# Altium schematic sheet H_Bridge.SchDoc
size A; SheetNumber: 9; SheetTotal: 9
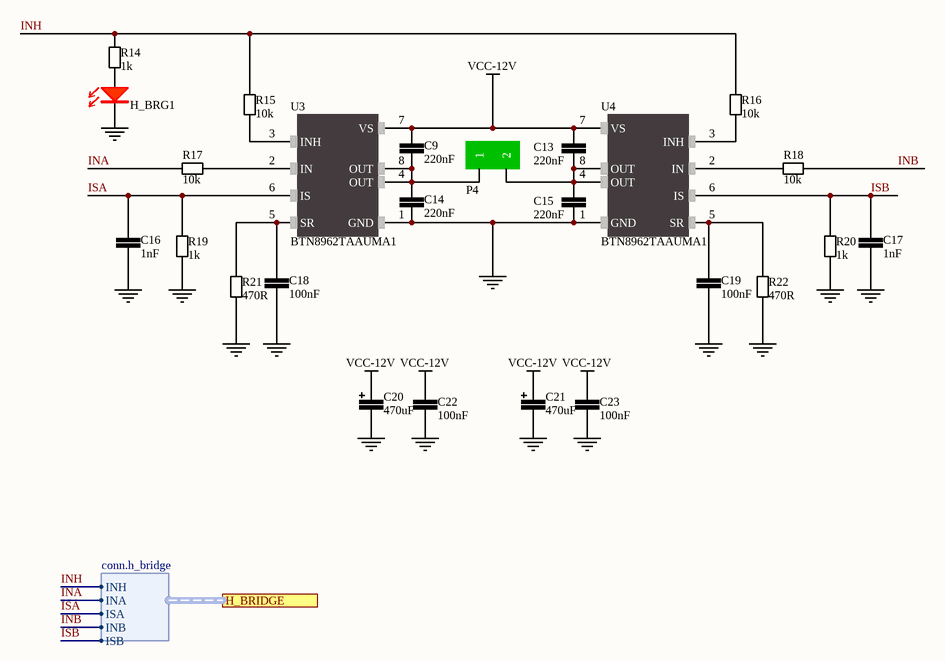
[diagram p0: H_Bridge.SchDoc]

## Parts
C9  220nF  [CER_0805]
C13  220nF  [CER_0805]
C14  220nF  [CER_0805]
C15  220nF  [CER_0805]
C16  1nF  [CER_0805]
C17  1nF  [CER_0805]
C18  100nF  [CER_0805]
C19  100nF  [CER_0805]
C20  470uF  [CAP10X20_RADIAL]
C21  470uF  [CAP10X20_RADIAL]
C22  100nF  [CER_0805]
C23  100nF  [CER_0805]
H_BRG1  LED RED  [LED_RED_0805]  (value not drawn)
P4  *  [MOTOR_CON]  (value not drawn)
R14  1k  [RESC2013X38N-0805-NOOVERLAY]
R15  10k  [RESC2013X38N-0805-NOOVERLAY]
R16  10k  [RESC2013X38N-0805-NOOVERLAY]
R17  10k  [RESC2013X38N-0805-NOOVERLAY]
R18  10k  [RESC2013X38N-0805-NOOVERLAY]
R19  1k  [RESC2013X38N-0805-NOOVERLAY]
R20  1k  [RESC2013X38N-0805-NOOVERLAY]
R21  470R  [RESC2013X38N-0805-NOOVERLAY]
R22  470R  [RESC2013X38N-0805-NOOVERLAY]
U3  BTN8962TAAUMA1  [TO263-7]
U4  BTN8962TAAUMA1  [TO263-7]

## Ports
H_BRIDGE (harness conn.h_bridge)

## Harnesses
conn.h_bridge: INH, INA, ISA, INB, ISB

## Nets
GND: C14.1 C15.1 C16.1 C17.1 C18.1 C19.1 C20.2 C21.2 C22.1 C23.1 H_BRG1.1(C) R19.1 R20.1 R21.1 R22.1 U3.1(GND) U4.1(GND)
VCC-12V: C9.2 C13.1 C20.1 C21.1 C22.2 C23.2 U3.7(VS) U4.7(VS)
INA: R17.2 ; port H_BRIDGE.INA
INB: R18.2 ; port H_BRIDGE.INB
INH: R14.2 R15.2 R16.2 ; port H_BRIDGE.INH
ISA: C16.2 R19.2 U3.6(IS) ; port H_BRIDGE.ISA
ISB: C17.2 R20.2 U4.6(IS) ; port H_BRIDGE.ISB
NetC9_1: C9.1 C14.2 P4.1 U3.4(OUT) U3.8(OUT)
NetC13_2: C13.2 C15.2 P4.2 U4.4(OUT) U4.8(OUT)
NetC18_2: C18.2 R21.2 U3.5(SR)
NetC19_2: C19.2 R22.2 U4.5(SR)
NetH_BRG1_2: H_BRG1.2(A) R14.1
NetR15_1: R15.1 U3.3(INH)
NetR16_1: R16.1 U4.3(INH)
NetR17_1: R17.1 U3.2(IN)
NetR18_1: R18.1 U4.2(IN)

## Library data of the parts
C9 C13-C15 = 00002205: CAP CER 220n 10V X5R 10% 0805; Capacitance: 220nF
C16 C17 = 00002105_1: CAP CER 1n 50V X7R 10% 0805; Capacitance: 1nF
C18 C19 C22 C23 = 00002105: CAP CER 100n 50V X7R 10% 0805; Capacitance: 100nF
C20 C21 = 00004707: CAP ALU 470u 25V 20%; Capacitance: 470uF
H_BRG1 = LED_RED_0805: LED RED 0805; Manufacturer: BRIGHT LED ELECTRONICS; Manufacturer Part Number: BL-HUB35A-AV-TRB; Barcode: 2911010024321; id: 35; Assembly: SMD; Voltage Forward: 2.0 V; item_id: 3341; Recommended Rating: Platinum; Package Case: 0805 (2012 Metric); Color: Red; Family: LED; Part Type: Optoelectronics
P4 = MOT_CONN: CONNECTOR FOR MOTOR OUTPUT; Manufacturer Part Number: *
R14 R19 R20 = 00001001: RES SMD 1 kOhm 1/8W 0805; Power: 0.125W, 1/8W; Barcode: 00009101; Resistance: 1k; Assembly: SMD
R15-R18 = 000001002: RES SMD 10 kOhm 1/8W 0805; Resistance: 10k
R21 R22 = 00004700: RES SMD 470 Ohm 1/8W 0805; Power: 0.125W, 1/8W; Barcode: 00006200; Resistance: 470R; Assembly: SMD
U3 U4 = 00000010: IC MOTOR DRIVER PAR TO263-7; Manufacturer Part Number: BTN8962TAAUMA1